# Altium schematic sheet DigiAnalog_Inputs.SchDoc: DigiAnalog inputs
size A4; Engineer: Danel Tiitma; Organization: MTÜ Tudengi Vormel; Address1: Pärnu mnt 62; Address2: Tallinn; Address3: Estonia, 10135; DocumentNumber: 11; Revision: 1; SheetNumber: 12; SheetTotal: 15
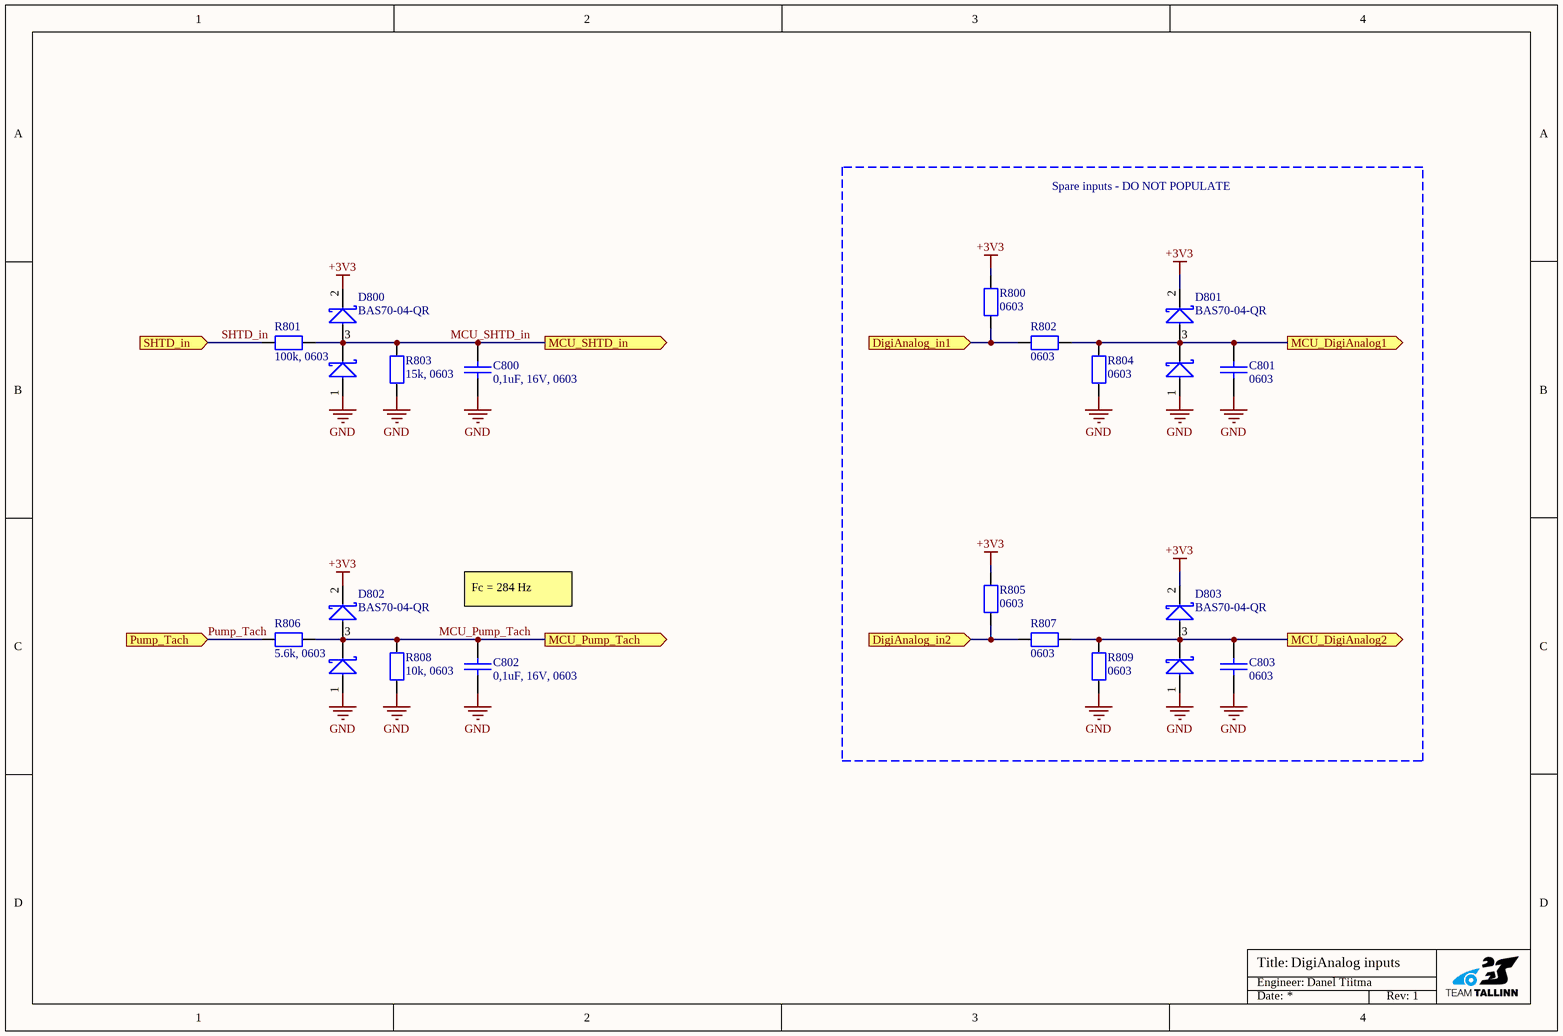
[diagram p0: DigiAnalog_Inputs.SchDoc]

## Parts
C800  0,1uF, 16V, 0603  [CAP [0603] 1608]
C801  0603  [CAP [0603] 1608]
C802  0,1uF, 16V, 0603  [CAP [0603] 1608]
C803  0603  [CAP [0603] 1608]
D800  BAS70-04-QR  [SOT23-3]
D801  BAS70-04-QR  [SOT23-3]
D802  BAS70-04-QR  [SOT23-3]
D803  BAS70-04-QR  [SOT23-3]
R800  0603  [RES [0603] 1608]
R801  100k, 0603  [RES [0603] 1608]
R802  0603  [RES [0603] 1608]
R803  15k, 0603  [RES [0603] 1608]
R804  0603  [RES [0603] 1608]
R805  0603  [RES [0603] 1608]
R806  5.6k, 0603  [RES [0603] 1608]
R807  0603  [RES [0603] 1608]
R808  10k, 0603  [RES [0603] 1608]
R809  0603  [RES [0603] 1608]

## Blocks framed on the sheet
Spare inputs - DO NOT POPULATE: C801 C803 D801 D803 R800 R802 R804 R805 R807 R809

## Ports
DigiAnalog_in1 (in), DigiAnalog_in2 (in), MCU_DigiAnalog1 (out), MCU_DigiAnalog2 (out), MCU_Pump_Tach (out), MCU_SHTD_in (out), Pump_Tach (in), SHTD_in (in)

## Nets
+3V3: D800.2 D801.2 D802.2 D803.2 R800.2 R805.2
GND: C800.2 C801.2 C802.2 C803.2 D800.1 D801.1 D802.1 D803.1 R803.1 R804.1 R808.1 R809.1
DigiAnalog_in1: R800.1 R802.2 ; port DigiAnalog_in1
DigiAnalog_in2: R805.1 R807.2 ; port DigiAnalog_in2
MCU_DigiAnalog1: C801.1 D801.3 R802.1 R804.2 ; port MCU_DigiAnalog1
MCU_DigiAnalog2: C803.1 D803.3 R807.1 R809.2 ; port MCU_DigiAnalog2
MCU_Pump_Tach: C802.1 D802.3 R806.2 R808.2 ; port MCU_Pump_Tach
MCU_SHTD_in: C800.1 D800.3 R801.2 R803.2 ; port MCU_SHTD_in
Pump_Tach: R806.1 ; port Pump_Tach
SHTD_in: R801.1 ; port SHTD_in

## Notes on the sheet
- Fc = 284 Hz
- Title:
- Engineer:
- Date:
- Rev:

## Library data of the parts
C800-C803 = CMP-001-00084-16: Default capacitor part; Supplier Part Number: *; Supplier: *; Manufacturer Part Number: *
D800-D803 = CMP-004-00033-4: Diode Small Signal Schottky 70V 70mA 3-Pin SOT-23 T/R; Manufacturer: Nexperia; Supplier Part Number: 771-BAS70-04-QR; Manufacturer Part Number: BAS70-04-QR; Supplier: Mouser; Price: 0,242
R800-R809 = CMP-009-00038-12: Standard resistor part; Supplier Part Number: *; Manufacturer Part Number: *; Supplier: *